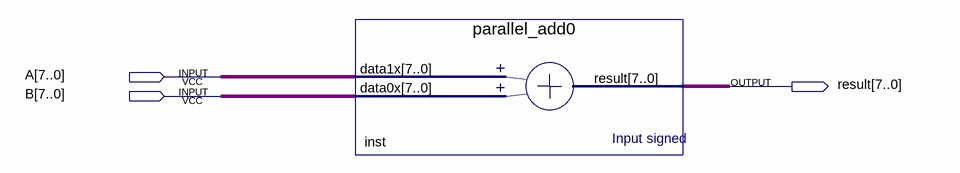
[diagram p0: schematic sheet]
// Quartus schematic ALU_add.bdf as structural Verilog: 1 symbols, 3 pins
module ALU_add (
  input  [7:0] A,
  input  [7:0] B,
  output [7:0] result
);

  parallel_add0 inst (.data1x(A), .data0x(B), .result(result));
endmodule
